# Altium project 10ADCDC.PrjPcb
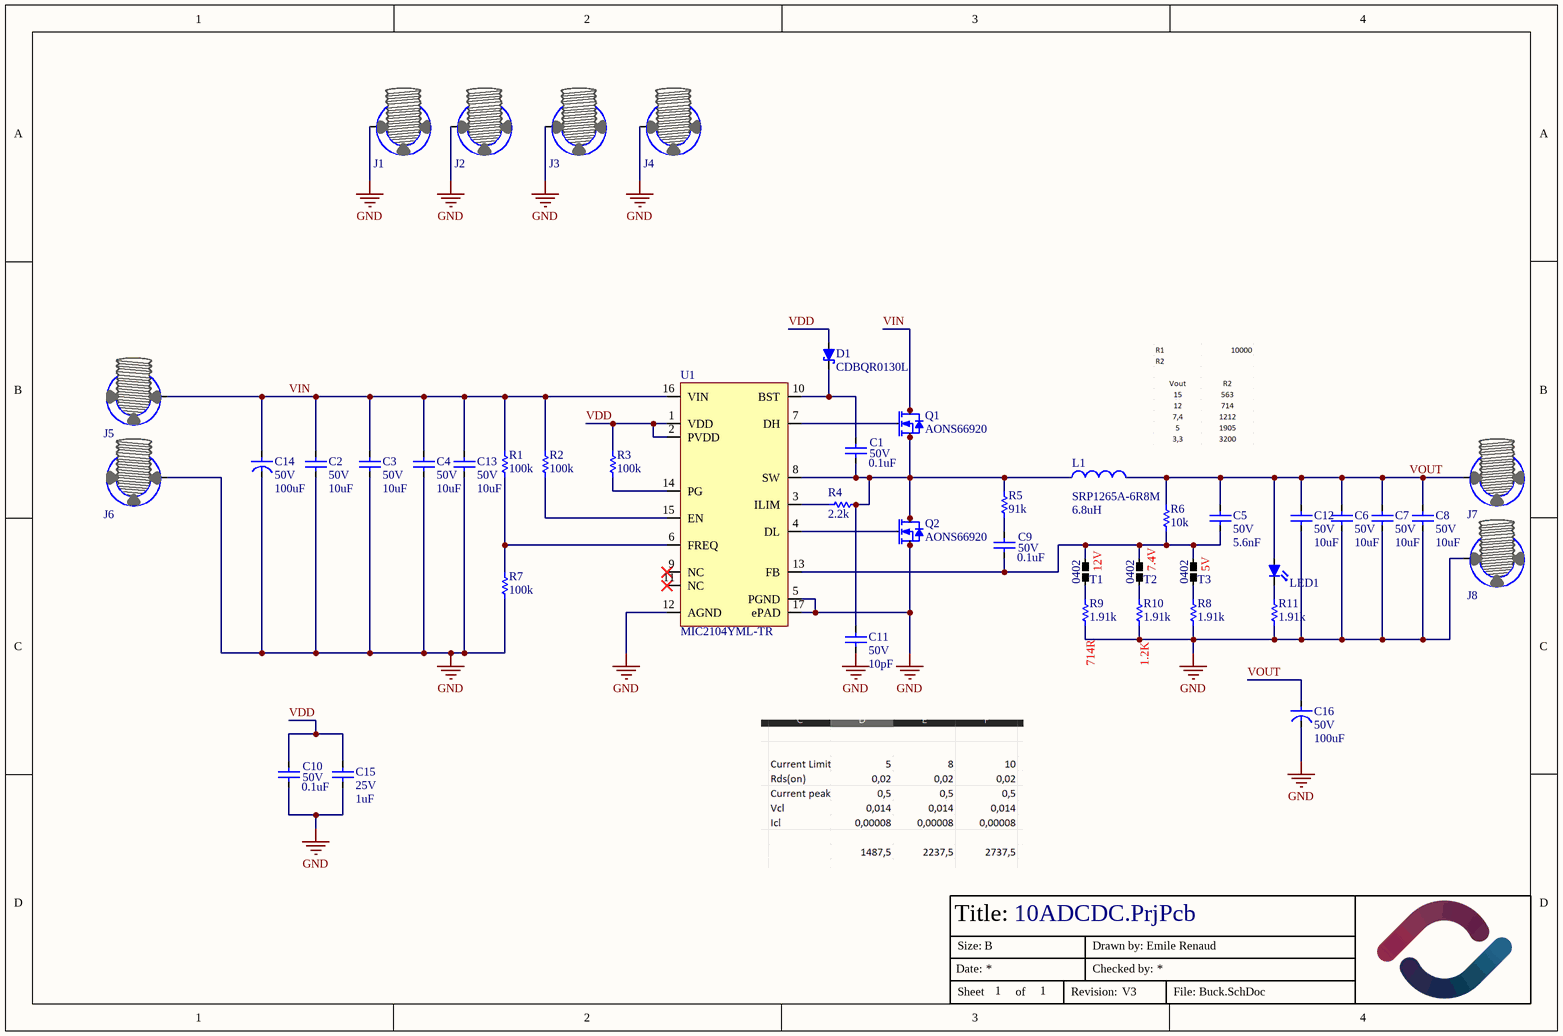
[diagram p0: Buck.SchDoc]
1 sheet, 44 parts. Net scope: global (net labels, ports and power ports of the same name join across sheets).
Board files: 10ADCDC.PcbDoc, 10ADCDC - Stencil.PcbDoc

## Sheet Buck.SchDoc
size A4; DrawnBy: Emile Renaud; Revision: V3; SheetNumber: 1; SheetTotal: 1

### Parts
C1  value 0.1uF  Volt: 50V  [CAPACITOR-0603]  (hidden comment: Capacitor-0603-0.1uF-50V-X7R)
C2  value 10uF  Volt: 50V  [CAPACITOR-1206]  (hidden comment: Capacitor-1206-10uF-50V-X5R)
C3  value 10uF  Volt: 50V  [CAPACITOR-1206]  (hidden comment: Capacitor-1206-10uF-50V-X5R)
C4  value 10uF  Volt: 50V  [CAPACITOR-1206]  (hidden comment: Capacitor-1206-10uF-50V-X5R)
C5  value 5.6nF  Volt: 50V  [CAPACITOR-0603]  (hidden comment: Capacitor-0603-0.1uF-50V-X7R)
C6  value 10uF  Volt: 50V  [CAPACITOR-1206]  (hidden comment: Capacitor-1206-10uF-50V-X5R)
C7  value 10uF  Volt: 50V  [CAPACITOR-1206]  (hidden comment: Capacitor-1206-10uF-50V-X5R)
C8  value 10uF  Volt: 50V  [CAPACITOR-1206]  (hidden comment: Capacitor-1206-10uF-50V-X5R)
C9  value 0.1uF  Volt: 50V  [CAPACITOR-0603]  (hidden comment: Capacitor-0603-0.1uF-50V-X7R)
C10  value 0.1uF  Volt: 50V  [CAPACITOR-0603]  (hidden comment: Capacitor-0603-0.1uF-50V-X7R)
C11  value 10pF  Volt: 50V  [CAPACITOR-0603]  (hidden comment: Capacitor-0603-10pF-50V-C0G)
C12  value 10uF  Volt: 50V  [CAPACITOR-1206]  (hidden comment: Capacitor-1206-10uF-50V-X5R)
C13  value 10uF  Volt: 50V  [CAPACITOR-1206]  (hidden comment: Capacitor-1206-10uF-50V-X5R)
C14  value 100uF  Volt: 50V  [CAP_J-V_8X10P5_RUB]  (hidden comment: CAP ALUM 100UF 20% 25V SMD)
C15  value 1uF  Volt: 25V  [CAPACITOR-0603]  (hidden comment: Capacitor-0603-1uF-25V-X5R)
C16  value 100uF  Volt: 50V  [CAP_J-V_8X10P5_RUB]  (hidden comment: CAP ALUM 100UF 20% 25V SMD)
D1  CDBQR0130L  [Diode-0402]
J1  hole  [HOLE-M2-Bolt]  (value not drawn)  (no BOM)
J2  hole  [HOLE-M2-Bolt]  (value not drawn)  (no BOM)
J3  hole  [HOLE-M2-Bolt]  (value not drawn)  (no BOM)
J4  hole  [HOLE-M2-Bolt]  (value not drawn)  (no BOM)
J5  hole  [HOLE-M2-Bolt]  (value not drawn)  (no BOM)
J6  hole  [HOLE-M2-Bolt]  (value not drawn)  (no BOM)
J7  hole  [HOLE-M2-Bolt]  (value not drawn)  (no BOM)
J8  hole  [HOLE-M2-Bolt]  (value not drawn)  (no BOM)
L1  SRP1265A-6R8M  value 6.8uH  [IND_SRP1265A-6R8M]
LED1  3147-B1931NB--20C007614U1930CT-ND  [LED-0603-2PIN]  (value not drawn)
Q1  AONS66920  [DFN-8-5x6-Power]
Q2  AONS66920  [DFN-8-5x6-Power]
R1  value 100k  [Resistor-0603]  (hidden comment: SMT resistor)
R2  value 100k  [Resistor-0603]  (hidden comment: SMT resistor)
R3  value 100k  [Resistor-0603]  (hidden comment: SMT resistor)
R4  value 2.2k  [Resistor-0603]  (hidden comment: SMT resistor)
R5  value 91k  [Resistor-0603]  (hidden comment: SMT resistor)
R6  value 10k  [Resistor-0603]  (hidden comment: SMT resistor)
R7  value 100k  [Resistor-0603]  (hidden comment: SMT resistor)
R8  value 1.91k  [Resistor-0603]  (hidden comment: SMT resistor)
R9  value 1.91k  [Resistor-0603]  (hidden comment: SMT resistor)
R10  value 1.91k  [Resistor-0603]  (hidden comment: SMT resistor)
R11  value 1.91k  [Resistor-0603]  (hidden comment: SMT resistor)
T1  NetTie_0402  [NetTie-0402]  (value not drawn)
T2  NetTie_0402  [NetTie-0402]  (value not drawn)
T3  NetTie_0402  [NetTie-0402]  (value not drawn)
U1  MIC2104YML-TR  [VQFN-16 3x3]

### Nets
GND: C2.1 C3.1 C4.1 C6.1 C7.1 C8.1 C10.1 C11.1 C12.1 C13.1 C14.2 C15.1 C16.2 J1.1 J2.1 J3.1 J4.1 J6.1 J8.1 Q2.1(S) Q2.2(S) Q2.3(S) R7.1 R8.1 R9.1 R10.1 R11.1 U1.5(PGND) U1.12(AGND) U1.17(ePAD)
VDD: C10.2 C15.2 D1.1(A) R3.2 U1.1(VDD) U1.2(PVDD)
VIN: C2.2 C3.2 C4.2 C13.2 C14.1 J5.1 Q1.5(D) Q1.6(D) Q1.7(D) Q1.8(D) R1.2 R2.2 U1.16(VIN)
VOUT: C5.2 C6.2 C7.2 C8.2 C12.2 C16.1 J7.1 L1.2 LED1.2(R) R6.2
NetC1_1: C1.1 C11.2 L1.1 Q1.1(S) Q1.2(S) Q1.3(S) Q2.5(D) Q2.6(D) Q2.7(D) Q2.8(D) R4.2 R5.2 U1.8(SW)
NetC1_2: C1.2 D1.2(K) U1.10(BST)
NetC5_1: C5.1 C9.1 R6.1 T1.1 T2.1 T3.1 U1.13(FB)
NetC9_2: C9.2 R5.1
NetLED1_1: LED1.1(K) R11.2
NetQ1_4: Q1.4(G) U1.7(DH)
NetQ2_4: Q2.4(G) U1.4(DL)
NetR1_1: R1.1 R7.2 U1.6(FREQ)
NetR2_1: R2.1 U1.15(EN)
NetR3_1: R3.1 U1.14(PG)
NetR4_1: R4.1 U1.3(ILIM)
NetR8_2: R8.2 T3.2
NetR9_2: R9.2 T1.2
NetR10_2: R10.2 T2.2

Not connected (* = marked no-connect by the designer): U1 9(NC)* 11(NC)*

### Notes on the sheet
- (near T1) 12V
- (near T2) 7.4V
- (near T3) 5V
- (near R9) 714R
- (near R10) 1.2K
- Title:
- Date:
- Size:
- B
- Drawn by:
- Checked by:
- Sheet
- of
- Revision:
- File:
- (in symbol NetTie_0402) 0402

### Library data of the parts
C1 C9 C10 = Capacitor-0603-0.1uF-50V-X7R: Precision: X7R-10%; Package / Case: Metric 1608, EIA 0603; Mounted: Yes; Supplier 1: Digi-Key; Supplier Part Number 1: 1276-1935-2-ND; Supplier 2: Digi-Key; Supplier Part Number 2: 1276-1934-2-ND
C2-C4 C6-C8 C12 C13 = Capacitor-1206-10uF-50V-X5R: Precision: X5R-10%; Package / Case: Metric 3216, EIA 1206; Mounted: Yes; Supplier 1: Digi-Key; Supplier Part Number 1: 1276-2876-1-ND; Supplier 2: Digi-Key
C5 = Capacitor-0603-5.6nF-50V-X7R: Precision: X7R-10%; Package / Case: Metric 1608, EIA 0603; Mounted: Yes; Supplier 1: Digi-Key; Supplier Part Number 1: 311-4100-1-ND; Supplier 2: Digi-Key
C11 = Capacitor-0603-10pF-50V-C0G: 10 pF ±5% 50V Ceramic Capacitor C0G 0603 (1608 Metric); Precision: X5R-10%; Mounted: Yes; Package / Case: Metric 1608 , EIA 0603; Supplier 1: Digikey; Supplier Part Number 1: 311-1058-1-ND
C14 C16 = Capacitor-100uF-50V-SMD: CAP ALUM 100UF 20% 50V SMD; Precision: 20%; Mounted: Yes; Supplier 1: Digi-Key; Supplier Part Number 1: 1189-1651-1-ND; Supplier 2: Digi-Key
C15 = Capacitor-0603-1uF-25V-X5R: Precision: X5R-10%; Package / Case: Metric 1608, EIA 0603; Mounted: Yes; Supplier 1: Digi-Key; Supplier Part Number 1: 1276-1859-2-ND; Supplier 2: Digi-Key; Supplier Part Number 2: 1276-1942-2-ND
D1 = CDBQR0130L: Diode SCHOTTKY  30 V 100mA Surface Mount 0402/SOD-923F; Volt: 30; Supplier 1: Digi-Key; Supplier Part Number 1: 641-1271-1-ND; Mounted: Yes; Package / Case: 0402/SOD-923F
J1-J8 = Hole 2.3mm M2: Hole for M2 Bolt with 4mm pad; Mounted: N/A
L1 = SRP1265A-6R8M: 6.8 µH Shielded Drum Core, Wirewound Inductor 11.5 A 11.5mOhm Max Nonstandard; Current: 11.5A; Supplier 1: Digi-Key; Mounted: Yes; Supplier Part Number 1: SRP1265A-6R8MCT-ND; Package / Case: SMD; HelpURL: https://www.bourns.com/docs/Product-Datasheets/SRP1265A.pdf
LED1 = LED_BLUE: LED BLUE CLEAR 0603 SMD; Package / Case: 0603 (1608 Metric); Mounted: Yes; Supplier 1: Digi-Key; Supplier Part Number 1: 3147-B1931NB--20C007614U1930CT-ND
Q1 Q2 = AONS66920: N-Channel 100 V 17.5A (Ta), 48A (Tc) 5W (Ta), 56.5W (Tc) Surface Mount 8-DFN (5x6); Volt: 60V; Current: 17.5A/48A; Supplier 1: Digi-Key; Supplier Part Number 1: 785-1843-1-ND; Package / Case: 8-DFN-EP (3x3); Mounted: Yes; Help URL: https://cms.aosmd.com/api/product/2026/combine-support-documents?resources=2241,4431,4739,6665,6939
R1-R3 R7 = Resistor-0603-100k: Resistor0603-100k; Precision: 1%; Watt: 0.1W; Mounted: Yes; Package / Case: Metric 1608, EIA 0603; Supplier 1: Digi-Key; Supplier Part Number 1: 311-100KHRCT-ND
R4 = Resistor-0603-2.2k: Resistor0603-2.2k; Precision: 1%; Watt: 0.1W; Mounted: Yes; Package / Case: Metric 1608, EIA 0603; Supplier 1: Digi-Key; Supplier Part Number 1: 311-2.20KHRCT-ND
R5 = Resistor-0603-91k: Resistor0603-91k; Precision: 1%; Watt: 0.1W; Mounted: Yes; Package / Case: Metric 1608, EIA 0603; Supplier 1: Digi-Key; Supplier Part Number 1: 311-91.0KHRCT-ND
R6 = Resistor-0603-10k: Resistor0603-10k; Precision: 1%; Watt: 0.1W; Mounted: Yes; Package / Case: Metric 1608, EIA 0603; Supplier 1: Digi-Key; Supplier Part Number 1: 311-10.0KHRTR-ND
R8-R11 = Resistor-0603-1.91k: Resistor0603-1.91k; Precision: 1%; Watt: 0.1W; Mounted: Yes; Package / Case: Metric 1608, EIA 0603; Supplier 1: Digi-Key; Supplier Part Number 1: 311-1.91KHRCT-ND
U1 = MIC2104YML-TR: Buck Regulator Positive Output Step-Down DC-DC Controller IC 16-MLF® (3x3); Grade: None; Supplier 1: Digi-Key; Supplier Part Number 1: 576-4157-1-ND; HelpURL: https://ww1.microchip.com/downloads/aemDocuments/documents/OTH/ProductDocuments/DataSheets/MIC2103_4-75V-Synchronous-Buck-Controllers-Featuring-Adaptive-ON-Time-Control-DS20005899B.pdf; Package / Case: 16-VFQFN Exposed Pad; Mounted: Yes